# Altium schematic sheet BoardIF.SchDoc
size A; SheetNumber: 4; SheetTotal: 7
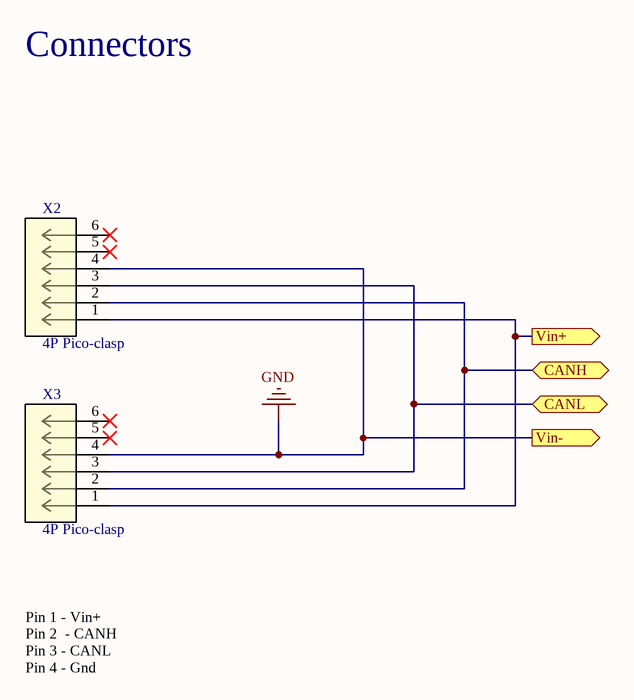
[diagram p0: BoardIF.SchDoc]

## Parts
X2  4P Pico-clasp  [CON_2023960407]
X3  4P Pico-clasp  [CON_2023960407]

## Ports
CANH (bidir, see CAN_TxRx[4B]), CANL (bidir, see CAN_TxRx[4C]), Vin+ (out, see PowerReg[1B]), Vin- (out)

## Nets
GND: X2.4 X3.4 ; port Vin-
CANH: X2.2 X3.2 ; port CANH
CANL: X2.3 X3.3 ; port CANL
Vin+: X2.1 X3.1 ; port Vin+

Not connected (* = marked no-connect by the designer): X2 5* 6*; X3 5* 6*

## Notes on the sheet
- Connectors
- Pin 1 - Vin+
  Pin 2  - CANH
  Pin 3 - CANL
  Pin 4 - Gnd

## Library data of the parts
X2 X3 = 202396-0407: Conn Shrouded Header (4 Sides) HDR 4 POS 1mm Solder RA SMD Pico-Clasp™ T/R; Manufacturer: Molex; Number of Positions: 4; Value: 2023960407; Supplier: Digi-Key; Supplier Part Number: WM26785CT-ND; Manufacturer Part Number: 202396-0407; RoHS: No; Category: Headers and Wire Housings; Stock: 4338; Pricing: 1=1.05, 10=0.869, 100=0.7238 (USD); Mounting Technology: Surface Mount; Contact Material: Bronze; Contact Shape: Square; Insulation Material: Nylon; Insulation Color: Natural; Contact Finish - Mating: GOLD; Min Operating Temperature: -40°C; Max Operating Temperature: 105°C; Connector Type: Header; Fastening Type: Latch; Packaging: Tape and Reel; Number of Rows: 1; Termination: Solder; Series: Pico-Clasp 202396; Contact Type: Male Pin; Flammability Rating: UL94 V-0; ComponentLink1URL: http://datasheet.octopart.com/202396-0407-Molex-datasheet-134623761.pdf?src-supplier=Avnet; ComponentLink1Description: http://datasheet.octopart.com/202396-0407-Molex-datasheet-134623761.pdf?src-supplier=Avnet; ComponentLink2URL: https://www.molex.com/pdm_docs/sd/2023960407_sd.pdf?src-supplier=Digi-Key; ComponentLink2Description: https://www.molex.com/pdm_docs/sd/2023960407_sd.pdf?src-supplier=Digi-Key; ComponentLink3URL: http://datasheet.octopart.com/202396-0407-Molex-datasheet-134623761.pdf?src-supplier=Digi-Key; ComponentLink3Description: http://datasheet.octopart.com/202396-0407-Molex-datasheet-134623761.pdf?src-supplier=Digi-Key; ComponentLink4URL: http://datasheet.octopart.com/202396-0407-Molex-datasheet-134623761.pdf?src-supplier=Farnell; ComponentLink4Description: http://datasheet.octopart.com/202396-0407-Molex-datasheet-134623761.pdf?src-supplier=Farnell; ComponentLink5URL: http://datasheet.octopart.com/202396-0407-Molex-datasheet-134623761.pdf?src-supplier=Newark; ComponentLink5Description: http://datasheet.octopart.com/202396-0407-Molex-datasheet-134623761.pdf?src-supplier=Newark; ComponentLink6URL: http://datasheet.octopart.com/202396-0407-Molex-datasheet-134623761.pdf?src-supplier=Mouser; ComponentLink6Description: http://datasheet.octopart.com/202396-0407-Molex-datasheet-134623761.pdf?src-supplier=Mouser; ComponentLink7URL: http://datasheet.octopart.com/202396-0407-Molex-datasheet-134623761.pdf?src-supplier=Heilind+Electronics; ComponentLink7Description: http://datasheet.octopart.com/202396-0407-Molex-datasheet-134623761.pdf?src-supplier=Heilind+Electronics; ComponentLink8URL: http://datasheet.octopart.com/202396-0407-Molex-datasheet-134623761.pdf?src-supplier=Electro+Sonic; ComponentLink8Description: http://datasheet.octopart.com/202396-0407-Molex-datasheet-134623761.pdf?src-supplier=Electro+Sonic; LCSC Part#: *